# Altium project EMG_Sensor_Board.PrjPcb (part 2 of 2)

## Sheet AFE.SchDoc: Analog Frontend
size A3; ApprovedBy: Robin Geißler; CheckedBy: Robin Geißler; Author: Robin Geißler; CompanyName: Fraunhofer EMFT; DrawnBy: Robin Geißler; Engineer: Robin Geißler; Revision: 1.1.; SheetNumber: 4; SheetTotal: 6
Used 2 times, as channels AFE1, AFE2. Parts and nets are listed once, with the designators drawn on the sheet.
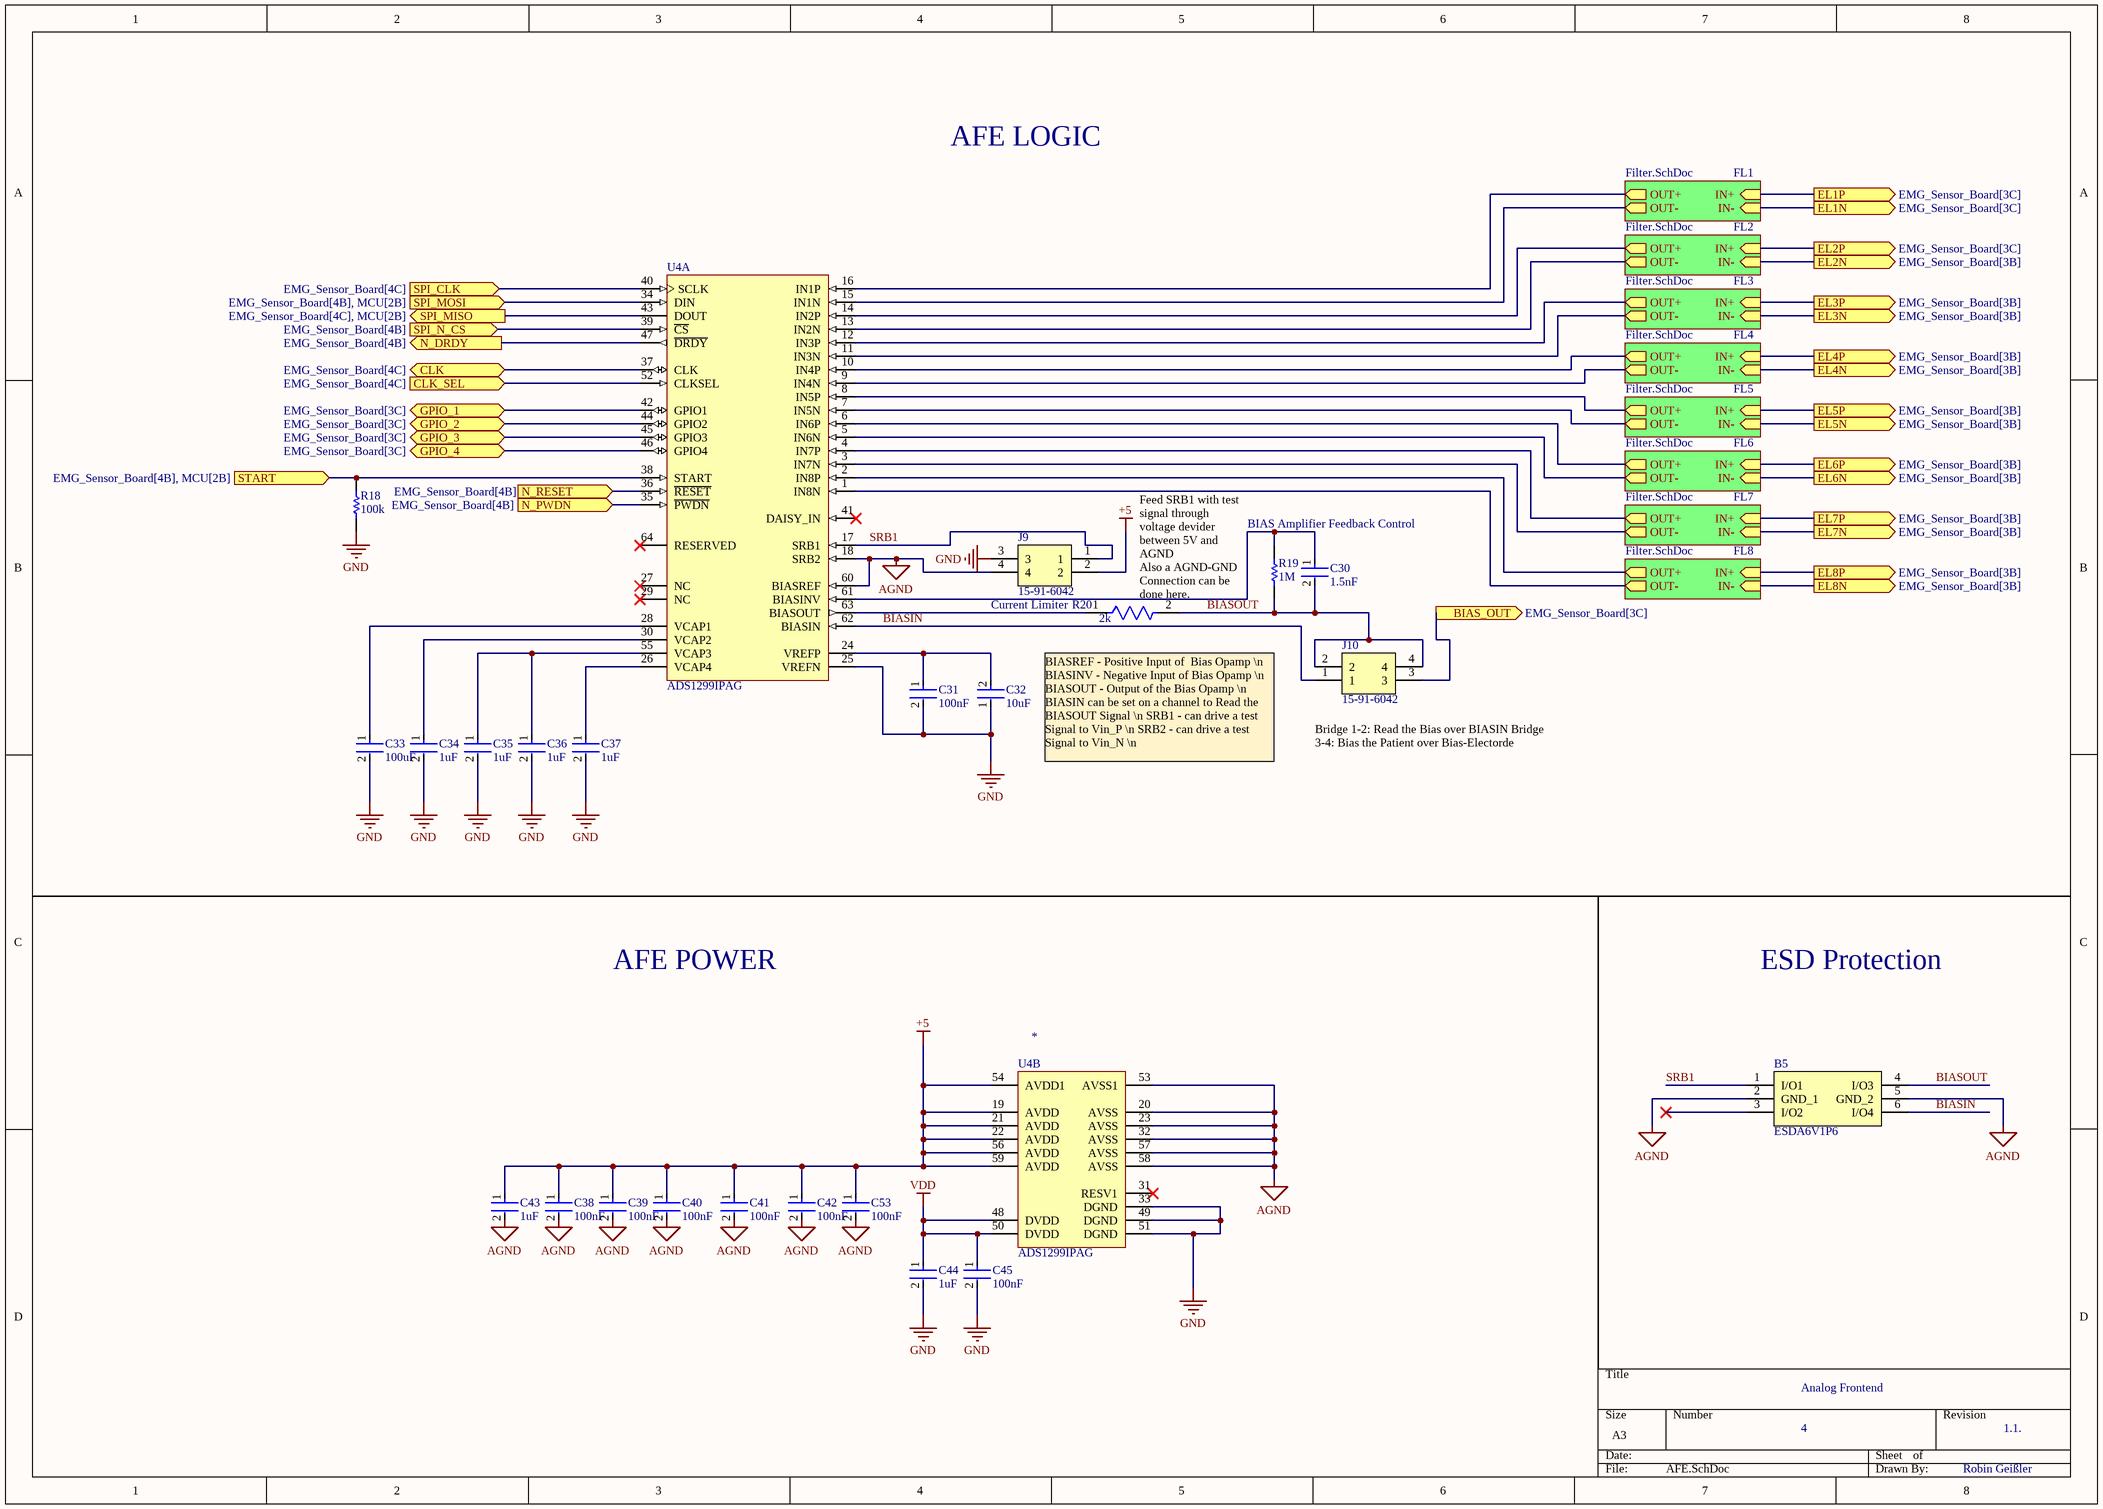
[diagram p3: AFE.SchDoc]

### Parts
B5  ESDA6V1P6  [ESDA6V1P6]
C30  1.5nF  [FP-GRM188-0_1-e0_2_0_5-IPC_B]
C31  100nF  [FP-CGA3E-0_3-0_1-IPC_A]
C32  10uF  [FP-C1608-080-0_1-MFG]
C33  100uF  [FP-C4532-280-0_4-IPC_B]
C34  1uF  [FP-CGA3E-0_3-0_1-IPC_B]
C35  1uF  [FP-CGA3E-0_3-0_1-IPC_B]
C36  1uF  [FP-CGA3E-0_3-0_1-IPC_B]
C37  1uF  [FP-CGA3E-0_3-0_1-IPC_B]
C38  100nF  [FP-CGA3E-0_3-0_1-IPC_A]
C39  100nF  [FP-CGA3E-0_3-0_1-IPC_A]
C40  100nF  [FP-CGA3E-0_3-0_1-IPC_A]
C41  100nF  [FP-CGA3E-0_3-0_1-IPC_A]
C42  100nF  [FP-CGA3E-0_3-0_1-IPC_A]
C43  1uF  [FP-CGA3E-0_3-0_1-IPC_B]
C44  1uF  [FP-CGA3E-0_3-0_1-IPC_B]
C45  100nF  [FP-CGA3E-0_3-0_1-IPC_A]
C53  100nF  [FP-CGA3E-0_3-0_1-IPC_A]
J9  15-91-6042  [15916042]
J10  15-91-6042  [15916042]
R18  100k  [RESC1609X55X30ML10T20]
R19  1M  [RESC1608X55X25LL10T15]
R20  2k  [FP-ERA3A-IPC_C]
U4  ADS1299IPAG  [PAG0064A_N]  (parts A,B of 2)

### Sub-sheets
FL1 = Filter.SchDoc: IN+ (in), IN- (in), OUT+ (out), OUT- (out)
FL2 = Filter.SchDoc: IN+ (in), IN- (in), OUT+ (out), OUT- (out)
FL3 = Filter.SchDoc: IN+ (in), IN- (in), OUT+ (out), OUT- (out)
FL4 = Filter.SchDoc: IN+ (in), IN- (in), OUT+ (out), OUT- (out)
FL5 = Filter.SchDoc: IN+ (in), IN- (in), OUT+ (out), OUT- (out)
FL6 = Filter.SchDoc: IN+ (in), IN- (in), OUT+ (out), OUT- (out)
FL7 = Filter.SchDoc: IN+ (in), IN- (in), OUT+ (out), OUT- (out)
FL8 = Filter.SchDoc: IN+ (in), IN- (in), OUT+ (out), OUT- (out)

### Ports
BIAS_OUT (out, see EMG_Sensor_Board[3C]), CLK (bidir, see EMG_Sensor_Board[4C]), CLK_SEL (in, see EMG_Sensor_Board[4C]), EL1N (out, see EMG_Sensor_Board[3C]), EL1P (out, see EMG_Sensor_Board[3C]), EL2N (out, see EMG_Sensor_Board[3B]), EL2P (out, see EMG_Sensor_Board[3C]), EL3N (out, see EMG_Sensor_Board[3B]), EL3P (out, see EMG_Sensor_Board[3B]), EL4N (out, see EMG_Sensor_Board[3B]), EL4P (out, see EMG_Sensor_Board[3B]), EL5N (out, see EMG_Sensor_Board[3B]), EL5P (out, see EMG_Sensor_Board[3B]), EL6N (out, see EMG_Sensor_Board[3B]), EL6P (out, see EMG_Sensor_Board[3B]), EL7N (out, see EMG_Sensor_Board[3B]), EL7P (out, see EMG_Sensor_Board[3B]), EL8N (out, see EMG_Sensor_Board[3B]), EL8P (out, see EMG_Sensor_Board[3B]), GPIO_1 (bidir, see EMG_Sensor_Board[3C]), GPIO_2 (bidir, see EMG_Sensor_Board[3C]), GPIO_3 (bidir, see EMG_Sensor_Board[3C]), GPIO_4 (bidir, see EMG_Sensor_Board[3C]), N_DRDY (out, see EMG_Sensor_Board[4B]), N_PWDN (in, see EMG_Sensor_Board[4B]), N_RESET (in, see EMG_Sensor_Board[4B]), SPI_CLK (in, see EMG_Sensor_Board[4C]), SPI_MISO (out, see EMG_Sensor_Board[4C], MCU[2B]), SPI_MOSI (in, see EMG_Sensor_Board[4B], MCU[2B]), SPI_N_CS (in, see EMG_Sensor_Board[4B]), START (in, see EMG_Sensor_Board[4B], MCU[2B])

### Nets
+5: C38.1 C39.1 C40.1 C41.1 C42.1 C43.1 C53.1 J9.2 U4.19(AVDD) U4.21(AVDD) U4.22(AVDD) U4.54(AVDD1) U4.56(AVDD) U4.59(AVDD)
AGND: B5.2(GND_1) B5.5(GND_2) C38.2 C39.2 C40.2 C41.2 C42.2 C43.2 C53.2 J9.4 U4.18(SRB2) U4.20(AVSS) U4.23(AVSS) U4.32(AVSS) U4.53(AVSS1) U4.57(AVSS) U4.58(AVSS) U4.60(BIASREF)
GND: C31.2 C32.1 C33.2 C34.2 C35.2 C36.2 C37.2 C44.2 C45.2 J9.3 R18.1 U4.25(VREFN) U4.33(DGND) U4.49(DGND) U4.51(DGND)
VDD: C44.1 C45.1 U4.48(DVDD) U4.50(DVDD)
BIAS_OUT: J10.3 ; port BIAS_OUT
BIASIN: B5.6(I/O4) J10.1 U4.62(BIASIN)
BIASOUT: B5.4(I/O3) C30.2 J10.2 J10.4 R19.1 R20.2
CLK: U4.37(CLK) ; port CLK
CLK_SEL: U4.52(CLKSEL) ; port CLK_SEL
EL1N: port EL1N, sheet FL1/IN-
EL1P: port EL1P, sheet FL1/IN+
EL2N: port EL2N, sheet FL2/IN-
EL2P: port EL2P, sheet FL2/IN+
EL3N: port EL3N, sheet FL3/IN-
EL3P: port EL3P, sheet FL3/IN+
EL4N: port EL4N, sheet FL4/IN-
EL4P: port EL4P, sheet FL4/IN+
EL5N: port EL5N, sheet FL5/IN-
EL5P: port EL5P, sheet FL5/IN+
EL6N: port EL6N, sheet FL6/IN-
EL6P: port EL6P, sheet FL6/IN+
EL7N: port EL7N, sheet FL7/IN-
EL7P: port EL7P, sheet FL7/IN+
EL8N: port EL8N, sheet FL8/IN-
EL8P: port EL8P, sheet FL8/IN+
GPIO_1: U4.42(GPIO1) ; port GPIO_1
GPIO_2: U4.44(GPIO2) ; port GPIO_2
GPIO_3: U4.45(GPIO3) ; port GPIO_3
GPIO_4: U4.46(GPIO4) ; port GPIO_4
N_DRDY: U4.47(~{DRDY}) ; port N_DRDY
N_PWDN: U4.35(~{PWDN}) ; port N_PWDN
N_RESET: U4.36(~{RESET}) ; port N_RESET
SPI_CLK: U4.40(SCLK) ; port SPI_CLK
SPI_MISO: U4.43(DOUT) ; port SPI_MISO
SPI_MOSI: U4.34(DIN) ; port SPI_MOSI
SPI_N_CS: U4.39(~{CS}) ; port SPI_N_CS
SRB1: B5.1(I/O1) J9.1 U4.17(SRB1)
START: R18.2 U4.38(START) ; port START
NetC30_1: C30.1 R19.2 U4.61(BIASINV)
NetC31_1: C31.1 C32.2 U4.24(VREFP)
NetC33_1: C33.1 U4.28(VCAP1)
NetC34_1: C34.1 U4.30(VCAP2)
NetC35_1: C35.1 C36.1 U4.55(VCAP3)
NetC37_1: C37.1 U4.26(VCAP4)
NetR20_1: R20.1 U4.63(BIASOUT)
NetU4_1: U4.1(IN8N) ; sheet FL8/OUT-
NetU4_2: U4.2(IN8P) ; sheet FL8/OUT+
NetU4_3: U4.3(IN7N) ; sheet FL7/OUT-
NetU4_4: U4.4(IN7P) ; sheet FL7/OUT+
NetU4_5: U4.5(IN6N) ; sheet FL6/OUT-
NetU4_6: U4.6(IN6P) ; sheet FL6/OUT+
NetU4_7: U4.7(IN5N) ; sheet FL5/OUT-
NetU4_8: U4.8(IN5P) ; sheet FL5/OUT+
NetU4_9: U4.9(IN4N) ; sheet FL4/OUT-
NetU4_10: U4.10(IN4P) ; sheet FL4/OUT+
NetU4_11: U4.11(IN3N) ; sheet FL3/OUT-
NetU4_12: U4.12(IN3P) ; sheet FL3/OUT+
NetU4_13: U4.13(IN2N) ; sheet FL2/OUT-
NetU4_14: U4.14(IN2P) ; sheet FL2/OUT+
NetU4_15: U4.15(IN1N) ; sheet FL1/OUT-
NetU4_16: U4.16(IN1P) ; sheet FL1/OUT+

Not connected (* = marked no-connect by the designer): B5 3(I/O2)*; U4 27(NC)* 29(NC)* 31(RESV1)* 41(DAISY_IN)* 64(RESERVED)*

### Channels
AFE1: designators B5=B5_AFE1 C30=C30_AFE1 C31=C?#1 C32=C?#2 C33=C?#3 C34=C?#4 C35=C?#5 C36=C?#6 C37=C?#7 C38=C?#9 C39=C?#10 C40=C?#11 C41=C?#12 C42=C?#13 C43=C?#8 C44=C?#14 C45=C?#15 C53=C53_AFE1 J9=J9_AFE1 J10=J10_AFE1 R18=R? R19=R19_AFE1 R20=R20_AFE1 U4=U?#1; ports BIAS_OUT=BIAS_OUT_1 CLK=NetU?#1_37 CLK_SEL=CLK_SEL_1 EL1N=NetC1_15 EL1P=NetC1_16 EL2N=NetC1_13 EL2P=NetC1_14 EL3N=NetC1_11 EL3P=NetC1_12 EL4N=NetC1_9 EL4P=NetC1_10 EL5N=NetC1_7 EL5P=NetC1_8 EL6N=NetC1_5 EL6P=NetC1_6 EL7N=NetC1_3 EL7P=NetC1_4 EL8N=NetC1_1 EL8P=NetC1_2 GPIO_1=NetR24_2 GPIO_2=NetU?#1_44 GPIO_3=NetU?#1_45 GPIO_4=NetU?#1_46 N_DRDY=N_DRDY_1 N_PWDN=N_PWDN_1 N_RESET=N_RESET_1 SPI_CLK=SPI_SCK SPI_MISO=SPI_MISO SPI_MOSI=SPI_MOSI SPI_N_CS=SPI_NCS_1 START=START
AFE2: designators B5=B5_AFE2 C30=C30_AFE2 C31=C31_AFE2 C32=C32_AFE2 C33=C33_AFE2 C34=C34_AFE2 C35=C35_AFE2 C36=C36_AFE2 C37=C37_AFE2 C38=C38_AFE2 C39=C39_AFE2 C40=C40_AFE2 C41=C41_AFE2 C42=C42_AFE2 C43=C43_AFE2 C44=C44_AFE2 C45=C45_AFE2 C53=C53_AFE2 J9=J9_AFE2 J10=J10_AFE2 R18=R18_AFE2 R19=R19_AFE2 R20=R20_AFE2 U4=U?#2; ports BIAS_OUT=BIAS_OUT_2 CLK=NetU?#1_37 CLK_SEL=CLK_SEL_2 EL1N=NetC1_31 EL1P=NetC1_32 EL2N=NetC1_29 EL2P=NetC1_30 EL3N=NetC1_27 EL3P=NetC1_28 EL4N=NetC1_25 EL4P=NetC1_26 EL5N=NetC1_23 EL5P=NetC1_24 EL6N=NetC1_21 EL6P=NetC1_22 EL7N=NetC1_19 EL7P=NetC1_20 EL8N=NetC1_17 EL8P=NetC1_18 GPIO_1=NetR25_1 GPIO_2=NetU?#2_44 GPIO_3=NetU?#2_45 GPIO_4=NetU?#2_46 N_DRDY=N_DRDY_2 N_PWDN=N_PWDN_2 N_RESET=N_RESET_2 SPI_CLK=SPI_SCK SPI_MISO=SPI_MISO SPI_MOSI=SPI_MOSI SPI_N_CS=SPI_NCS_2 START=START

### Notes on the sheet
- AFE LOGIC
- BIAS Amplifier Feedback Control
- Current Limiter
- (near R20) Feed SRB1 with test signal through voltage devider between 5V and AGND
  Also a AGND-GND Connection can be done here.
- BIASREF - Positive Input of  Bias Opamp \n BIASINV - Negative Input of Bias Opamp \n BIASOUT - Output of the Bias Opamp \n BIASIN can be set on a channel to Read the BIASOUT Signal \n SRB1 - can drive a test Signal to Vin_P \n SRB2 - can drive a test Signal to Vin_N \n
- (near J10) Bridge 1-2: Read the Bias over BIASIN Bridge 3-4: Bias the Patient over Bias-Electorde
- AFE POWER
- ESD Protection

### Library data of the parts
B5 = ESDA6V1P6: 4 line ESD protection, 6.1 V VBR, in SOT666; Manufacturer_Name: STMicroelectronics; Geometry.Height: 0.62mm; Manufacturer_Part_Number: ESDA6V1P6; Mouser Part Number: 511-ESDA6V1P6; Mouser Price/Stock: https://www.mouser.co.uk/ProductDetail/STMicroelectronics/ESDA6V1P6?qs=ewe0KQ%2FSs5H0%252BSAub%2FR2ag%3D%3D; Arrow Part Number: ESDA6V1P6; Arrow Price/Stock: https://www.arrow.com/en/products/esda6v1p6/stmicroelectronics?region=nac; Datasheet Link: https://www.st.com/resource/en/datasheet/esda14v2bp6.pdf; Supplier 1: Mouser; Supplier Part Number 1: 511-ESDA6V1P6
C30 = CMP-06035-043535-1: Chip Multilayer Ceramic Capacitors for General Purpose, 0603, 1500pF, C0G, 30ppm/°C, 5%, 50V; Insulation Resistance: 10GR; Lead Free: Lead Free; REACH SVHC: No SVHC; Dielectric: C0G; Package Quantity: 1; Case/Package: 0603; Material: Ceramic; Height: 0.8mm; Length: 1.6mm; Max Operating Temperature: 125°C; Thickness: 0.035inch; Mount: Surface Mount; Depth: 0.8mm; Case Code (Metric): 1608; Dielectric Material: Ceramic; Radiation Hardening: No; Capacitance: 1.5nF; Termination: SMD/SMT; Tolerance: 5%; Number of Pins: 2; Temperature Coefficient: 30ppm/°C; Packaging: Tape and Reel; Width: 0.8mm; Voltage: 50V; Case Code (Imperial): 0603; Voltage Rating: 50V; Voltage Rating (DC): 50V; Min Operating Temperature: -55°C
C31 C38-C42 C45 C53 = CMP-2000-07546-2: Cap Ceramic 100nF 50V X7R 10% Pad SMD 0603 +125°C Automotive T/R; Weight: 7.1E-05oz; Composition: Ceramic; Max Operating Temperature: 125°C; Termination: SMD/SMT; Dielectric: X7R; Length: 1.6mm; Package Quantity: 1; REACH SVHC: No SVHC; Lead Free: Lead Free; Case Code (Metric): 1608; Min Operating Temperature: -55°C; Packaging: Tape and Reel; Tolerance: 10%; Voltage Rating: 50V; Case Code (Imperial): 0603; Capacitance: 100nF; Case/Package: 0603; Voltage Rating (DC): 50V; Depth: 0.8mm; Radiation Hardening: No; Ratings: AEC-Q200; Mount: Surface Mount; Voltage: 50V; Thickness: 0.035inch; Width: 0.8mm; Height: 0.8mm
C32 = CMP-2000-04979-3: Multilayer Ceramic Capacitors 10μF ±10% 10V X5R SMD 0603; Dielectric Material: Ceramic; Construction: Flat; Height: 0.8mm; Thickness: 0.035inch; Case Code (Metric): 1608; Radiation Hardening: No; Number of Pins: 2; Voltage Rating (DC): 10V; Depth: 0.8mm; Voltage: 10V; RoHS Compliant: Yes; Voltage Rating: 10V; Package Quantity: 1; Resistor Type: Ceramic; Termination: SMD/SMT; Lead Free: Lead Free; REACH SVHC: No SVHC; Tolerance: 10%; Mount: Surface Mount; Series: C; Packaging: Tape and Reel; Width: 0.8mm; Dielectric: X5R; Weight: 7.1E-05oz; Length: 1.6mm; Max Operating Temperature: 85°C; Case Code (Imperial): 0603; Case/Package: 0603; Min Operating Temperature: -55°C; Capacitance: 10uF
C33 = CMP-08246-002633-1: CAP CER 100UF 6.3V X6S 1812; Tolerance: 20%; Dielectric Material: Ceramic; Min Operating Temperature: -55°C; Package Quantity: 500; Voltage Rating (DC): 6.3V; Width: 0.126inch; Packaging: Tape and Reel; Series: C; Case Code (Metric): 4532; Lead Free: Lead Free; Mount: Surface Mount; Case Code (Imperial): 1812; Max Operating Temperature: 105°C; Capacitance: 100uF; Length: 0.177inch; Case/Package: 1812; Voltage Rating: 6.3V; Thickness: 0.122inch; RoHS Compliant: Yes
C34-C37 C43 C44 = CMP-08246-002551-1: Cap Ceramic 1uF 35V X7R 10% Pad SMD 0603 +125°C Automotive T/R; Termination: SMD/SMT; Packaging: Tape and Reel; Capacitance: 1uF; Tolerance: 10%; Mount: Surface Mount; Thickness: 0.035inch; Case Code (Imperial): 0603; Voltage Rating: 35V; Case/Package: 0603; Case Code (Metric): 1608; Dielectric: X7R; Width: 0.031inch; Length: 0.063inch; Min Operating Temperature: -55°C; Weight: 7.1E-05oz; Max Operating Temperature: 125°C; Voltage Rating (DC): 35V; Height: 0.8mm; Ratings: AEC-Q200; Package Quantity: 4000
J9 J10 = 15-91-6042: 2.54mm Pitch SL Wire-to-Board Header, Low Profile, Surface Mount, Single Row, Right-Angle, 3.05mm Pocket, Shrouded, with Press-fit Plastic Peg,  Circuits, Tin (Sn) Plating, Embossed Tape Packaging; Manufacturer_Name: Molex; Geometry.Height: 11.69mm; Manufacturer_Part_Number: 15-91-6042; Mouser Part Number: 538-15-91-6042; Mouser Price/Stock: https://www.mouser.co.uk/ProductDetail/Molex/15-91-6042?qs=3DzawVMofg8HeBuyct9LCA%3D%3D; Arrow Part Number: *; Arrow Price/Stock: *; Datasheet Link: https://componentsearchengine.com/Datasheets/1/15-91-6042.pdf
R18 = CMP-2000-03685-1: TNPW0603100KBEEA; Manufacturer: Vishay Dale; Part Number: TNPW0603100KBEEA
R19 = CMP-1659-00056-1: Chip Resistor, 1 MOhm, +/- 1%, 100 mW, -55 to 155 degC, 0603 (1608 Metric), RoHS, Tape and Reel; Voltage Rating (DC): 25 V; Tolerance: 20%; Case\Package: Radial; Capacitance: 1 mF; Min Operating Temperature: -40 degC; PackageDescription: 2-Pin Surface Mount Device, Body 1.6 x 0.8 mm; ComponentLink1Description: Manufacturer URL; Radiation Hardening: No; DatasheetVersion: Rev. 4, 02/2016; REACH SVHC: No SVHC; Length: 20 mm; Max Operating Temperature: 85 degC; Diameter: 10 mm; Packaging: Bulk; Package Quantity: 200; PackageReference: 0603; Mount: Through Hole; ComponentLink1URL: http://www.yageo.com/; ComponentLink2URL: http://www.yageo.com/documents/recent/PYu-RC_Group_51_RoHS_L_04.pdf; ComponentLink2Description: Datasheet; Width: 0 inch; Lead Pitch: 5 mm; RoHSCompliant: true; Voltage Rating: 25 V; Height: 20 mm
R20 = CMP-2000-00945-2: RES SMD 2K OHM 0.1% 1/10W 0603; Resistance: 2kR; Max Power Dissipation: 100mW; Voltage Rating (DC): 75V; Temperature Coefficient: 25ppm/°C; REACH SVHC: No SVHC; Number of Terminations: 2; RoHS Compliant: Yes; Case Code (Metric): 1608; Package Quantity: 5000; Width: 0.8mm; Mount: Surface Mount; Series: ERA-3A; Number of Pins: 2; Height: 0.45mm; Military Standard: Not; Packaging: Tape and Reel; Resistor Type: Thin Film; Lead Free: Lead Free; Construction: Rectangular; Max Operating Temperature: 155°C; Contact Plating: Tin; Termination: SMD/SMT; Technology: THIN FILM; Length: 1.6mm; Power Rating: 100mW; Resistance Tolerance: 0.1%; Working Voltage: 75V; Voltage Rating: 75V; Depth: 0.8mm; Case Code (Imperial): 0603; Radiation Hardening: No; Case/Package: 0603; Tolerance: 0.1%; Min Operating Temperature: -55°C
U4 = CMP-0841-00002-2: Low-Noise, 8-Channel, 24-Bit Analog Front-End for Biopotential Measurement, 16 KSPS, -40 to 85 degC, 64-Pin PQFP (PAG-64), RoHS, Tube; Manufacturer: Texas Instruments; Architecture: Delta-Sigma; Reference Mode: Int, Ext; # Input Channels: 8; Resolution (Bits): 24; Sample Rate (max) (KSPS): 16; Interface: Serial SPI; Packing: PAG0064A; PackageVersion: 4040282/C; PackageReference: PAG-64; ComponentLink3Description: Package Specification; DatasheetVersion: SBAS499A; ComponentLink1Description: Manufacturer URL; ComponentLink2Description: Datasheet; PackageDescription: 64-Pin Plastic Quad Flatpack, Body 10 x 10 mm, Pitch 0.5 mm; RoHS: TRUE; Operating Temperature Range (C): -40 to 85; ComponentLink3URL: http://www.ti.com/lit/ml/mtqf006a/mtqf006a.pdf; ComponentLink1URL: http://www.ti.com/; ComponentLink2URL: http://www.ti.com/lit/ds/symlink/ads1299.pdf; PartNumber: ADS1299IPAG; Mounting Technology: Surface Mount

## Sheet Filter.SchDoc: Filter
size A4; Author: Robin Geißler; CompanyName: Fraunhofer EMFT; DrawnBy: Robin Geißler; Revision: 1.1.; SheetNumber: 5; SheetTotal: 6
Used 16 times, as channels AFE1/FL7, AFE1/FL6, AFE1/FL8, AFE1/FL5, AFE1/FL4, AFE1/FL3, AFE1/FL2, AFE1/FL1, AFE2/FL7, AFE2/FL6, AFE2/FL8, AFE2/FL5, AFE2/FL4, AFE2/FL3, AFE2/FL2, AFE2/FL1. Parts and nets are listed once, with the designators drawn on the sheet.
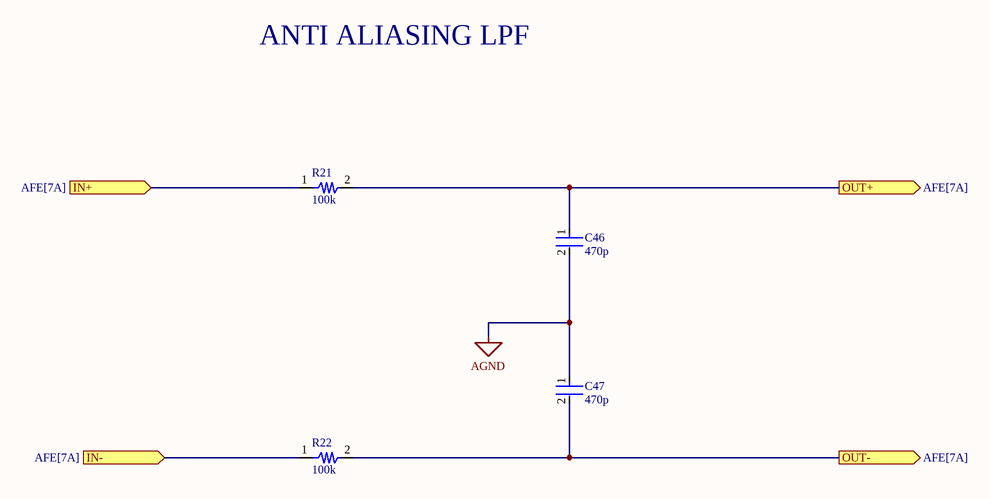
[diagram p4: Filter.SchDoc]

### Parts
C46  470p  [FP-C0603C-CF-MFG]
C47  470p  [FP-C0603C-CF-MFG]
R21  100k  [R-1608 [0603]-M]
R22  100k  [R-1608 [0603]-M]

### Ports
IN+ (in, see AFE[7A]), IN- (in, see AFE[7A]), OUT+ (out, see AFE[7A]), OUT- (out, see AFE[7A])

### Nets
AGND: C46.2 C47.1
IN+: R21.1 ; port IN+
IN-: R22.1 ; port IN-
OUT+: C46.1 R21.2 ; port OUT+
OUT-: C47.2 R22.2 ; port OUT-

### Channels
AFE1/FL7: designators end in _AFE1_FL7; ports IN+=NetC1_4 IN-=NetC1_3 OUT+=NetC46_AFE1_FL7_1 OUT-=NetC47_AFE1_FL7_2
AFE1/FL6: designators end in _AFE1_FL6; ports IN+=NetC1_6 IN-=NetC1_5 OUT+=NetC46_AFE1_FL6_1 OUT-=NetC47_AFE1_FL6_2
AFE1/FL8: designators end in _AFE1_FL8; ports IN+=NetC1_2 IN-=NetC1_1 OUT+=NetC46_AFE1_FL8_1 OUT-=NetC47_AFE1_FL8_2
AFE1/FL5: designators end in _AFE1_FL5; ports IN+=NetC1_8 IN-=NetC1_7 OUT+=NetC46_AFE1_FL5_1 OUT-=NetC47_AFE1_FL5_2
AFE1/FL4: designators end in _AFE1_FL4; ports IN+=NetC1_10 IN-=NetC1_9 OUT+=NetC46_AFE1_FL4_1 OUT-=NetC47_AFE1_FL4_2
AFE1/FL3: designators end in _AFE1_FL3; ports IN+=NetC1_12 IN-=NetC1_11 OUT+=NetC46_AFE1_FL3_1 OUT-=NetC47_AFE1_FL3_2
AFE1/FL2: designators end in _AFE1_FL2; ports IN+=NetC1_14 IN-=NetC1_13 OUT+=NetC46_AFE1_FL2_1 OUT-=NetC47_AFE1_FL2_2
AFE1/FL1: designators end in _AFE1_FL1; ports IN+=NetC1_16 IN-=NetC1_15 OUT+=NetC46_AFE1_FL1_1 OUT-=NetC47_AFE1_FL1_2
AFE2/FL7: designators end in _AFE2_FL7; ports IN+=NetC1_20 IN-=NetC1_19 OUT+=NetC46_AFE2_FL7_1 OUT-=NetC47_AFE2_FL7_2
AFE2/FL6: designators end in _AFE2_FL6; ports IN+=NetC1_22 IN-=NetC1_21 OUT+=NetC46_AFE2_FL6_1 OUT-=NetC47_AFE2_FL6_2
AFE2/FL8: designators end in _AFE2_FL8; ports IN+=NetC1_18 IN-=NetC1_17 OUT+=NetC46_AFE2_FL8_1 OUT-=NetC47_AFE2_FL8_2
AFE2/FL5: designators end in _AFE2_FL5; ports IN+=NetC1_24 IN-=NetC1_23 OUT+=NetC46_AFE2_FL5_1 OUT-=NetC47_AFE2_FL5_2
AFE2/FL4: designators end in _AFE2_FL4; ports IN+=NetC1_26 IN-=NetC1_25 OUT+=NetC46_AFE2_FL4_1 OUT-=NetC47_AFE2_FL4_2
AFE2/FL3: designators end in _AFE2_FL3; ports IN+=NetC1_28 IN-=NetC1_27 OUT+=NetC46_AFE2_FL3_1 OUT-=NetC47_AFE2_FL3_2
AFE2/FL2: designators end in _AFE2_FL2; ports IN+=NetC1_30 IN-=NetC1_29 OUT+=NetC46_AFE2_FL2_1 OUT-=NetC47_AFE2_FL2_2
AFE2/FL1: designators end in _AFE2_FL1; ports IN+=NetC1_32 IN-=NetC1_31 OUT+=NetC46_AFE2_FL1_1 OUT-=NetC47_AFE2_FL1_2

### Notes on the sheet
- ANTI ALIASING LPF

### Library data of the parts
C46 C47 = CMP-1035-01678-2: C0603 470 pF C0G 30ppm/°C 1.00% 100 V; Manufacturer: KEMET; Manufacturer Part Number: C0603C471F1GACTU; Material: Ceramic; Automotive Grade: Grade 1; Voltage Rating: 100 V; Capacitance: 470 pF; Value: 470 pF; Tolerance: 0.01; RoHS: TRUE; Lead Free: Yes; Category: Cap; ComponentLink2Description: Datasheet; Temperature Range Low: -55°C; Temperature: -55°C to +125°C; Mouser Description: Multilayer Ceramic Capacitors MLCC - SMD/SMT 100volts 470pF 1% C0G; Device Class L2: Capacitors; Octopart: https://octopart.com/c0603c471f1gactu-kemet-26647159; Device Class L3: Ceramic Capacitors; Temperature Characteristic: C0G; Device Class L1: Passive Components; Temperature Coefficient: 30ppm/°C; Temperature Range High: +125°C; ComponentLink2URL: https://api.kemet.com/component-edge/download/datasheet/C0603C100J5GACAUTO.pdf; Automotive: Yes; Package: C0603C-CF; Height: 0.87mm
R21 R22 = Precision_Resistor: Expensive: P2TC0603D1003LNTA - 0.01% Cheap: TNPU0603100KAYEN00 - 0.05%; Supplier 1: Rs; Supplier Part Number 1: 2182743P; Supplier 2: Arrow Electronics; Supplier Part Number 2: TNPU0603100KAYEN00

## Sheet RF.SchDoc: Radio Frequency
size A4; Author: Robin Geißler; CompanyName: Fraunhofer EMFT; DrawnBy: Robin Geißler; Revision: 1.1.; SheetNumber: 6; SheetTotal: 6
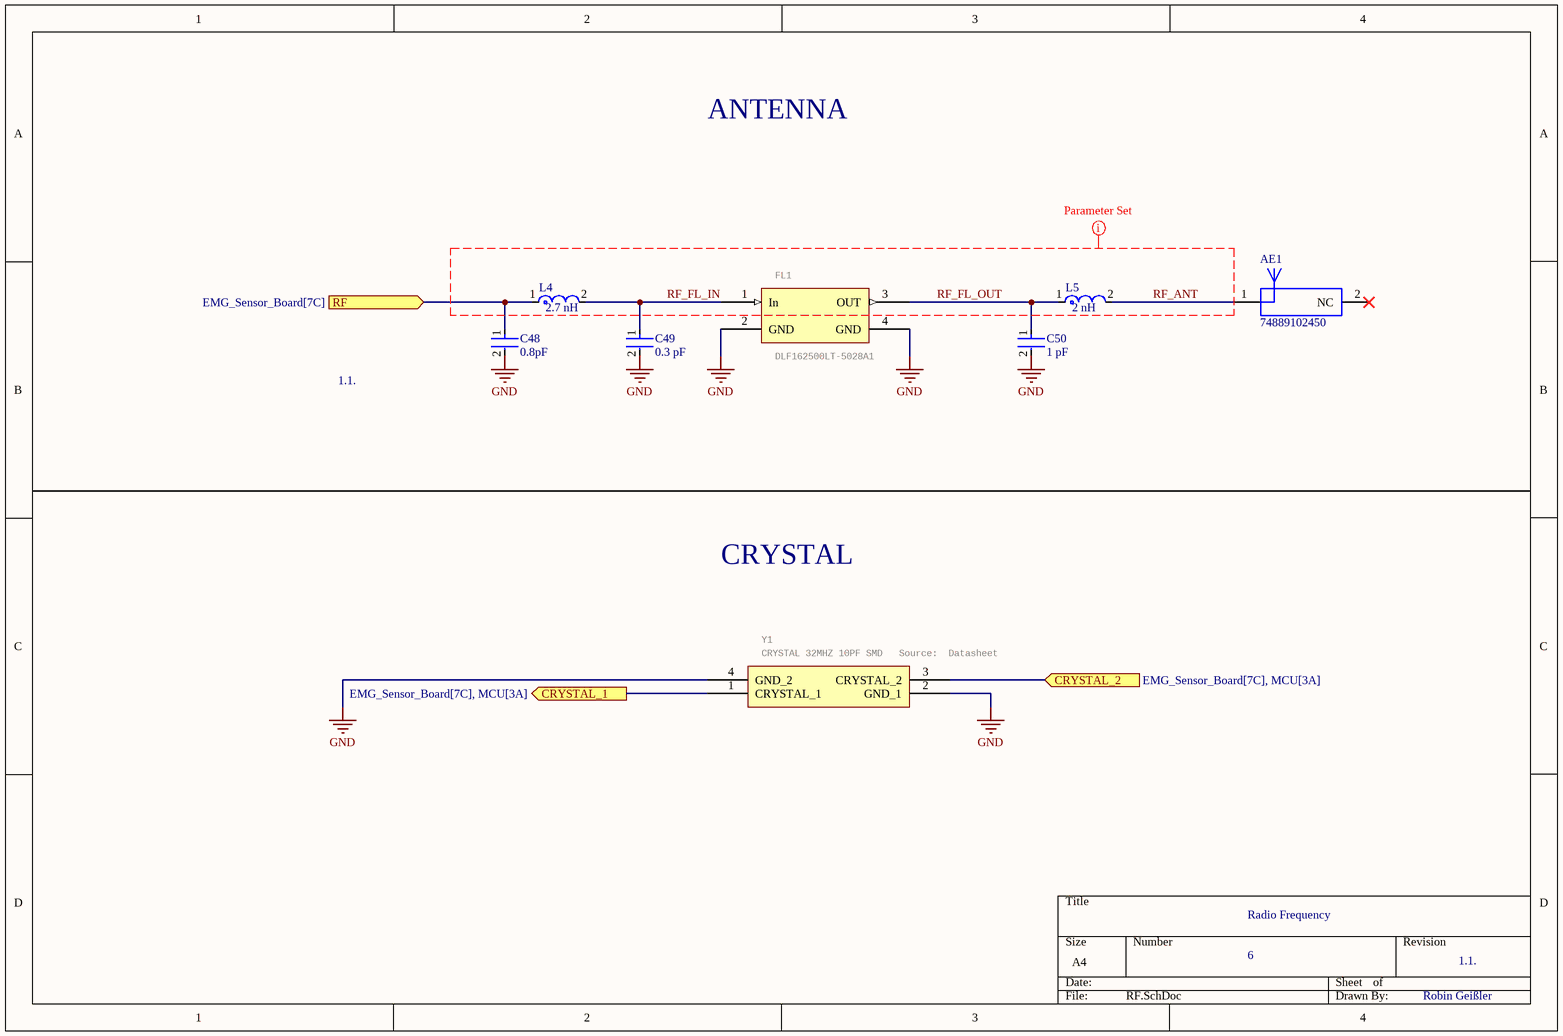
[diagram p5: RF.SchDoc]

### Parts
AE1  74889102450  [74889102450]
C48  0.8pF  [FP-GCM188-0_1-IPC_C]
C49  0.3 pF  [FP-GQM187-0_15-IPC_A]
C50  1 pF  [FP-C0603C-CF-MFG]
FL1  DLF162500LT-5028A1  [DLF162500LT5028A1]
L4  2.7 nH  [FP-LQG15HH_02-IPC_C]
L5  2 nH  [FP-LQP03TG_02-IPC_A]
Y1  CRYSTAL 32MHZ 10PF SMD   Source:  Datasheet  [NX2016SA32MEXS00ACS06465]

### Ports
CRYSTAL_1 (out, see EMG_Sensor_Board[7C], MCU[3A]), CRYSTAL_2 (in, see EMG_Sensor_Board[7C], MCU[3A]), RF (in, see EMG_Sensor_Board[7C])

### Nets
GND: C48.2 C49.2 C50.2 FL1.2(GND) FL1.4(GND) Y1.2(GND_1) Y1.4(GND_2)
CRYSTAL_1: Y1.1(CRYSTAL_1) ; port CRYSTAL_1
CRYSTAL_2: Y1.3(CRYSTAL_2) ; port CRYSTAL_2
RF1: C48.1 L4.1 ; port RF
RF_ANT: AE1.1(Feed) L5.2
RF_FL_IN: C49.1 FL1.1(In) L4.2
RF_FL_OUT: C50.1 FL1.3(OUT) L5.1

Not connected (* = marked no-connect by the designer): AE1 2(NC)*

### Layout directives
net class RF: RF_ANT, RF_FL_IN, RF_FL_OUT

### Notes on the sheet
- ANTENNA
- CRYSTAL

### Library data of the parts
AE1 = CMP-03913-126098686-1: 74889102450 Chip Antenna, 2.45Ghz, 9Mm X 2Mm X 1Mm Rohs Compliant: Yes; Current Rating: 2A; Impedance: 50Ω; Height: 1.01mm; RoHS: Compliant; Max Operating Temperature: 85°C; NexarPartId: 126098686; Min Operating Temperature: -40°C; Width: 2mm; Length: 9mm
C48 = CMP-06035-009191-1: Ceramic Capacitor for Automotive 0.8pF  ±0.1pF 100VDC C0G 0603 Paper T/R
C49 = CMP-06035-023113-1: Ceramic Capacitor 0.3pF ±0.05pF 250VDC C0G 0603 Paper T/R
C50 = CMP-2006-03328-2: CAP CER 1PF 50V C0G/NP0 0603; Manufacturer: KEMET; Manufacturer Part Number: C0603C109C5GACTU; Value: 1.0 pF; Temperature Characteristic: C0G; Tolerance: 0.25 pF; Temperature Coefficient: 30ppm/°C; Automotive Grade: Grade 1; Material: Ceramic; Device Class L1: Passive Components; Temperature Range High: +125°C; Temperature: -55°C to +125°C; Height: 0.87mm; Digikey Description: CAP CER 1PF 50V C0G/NP0 0603; Voltage Rating: 50 V; ComponentLink2Description: Datasheet; Capacitance: 1.0 pF; Lead Free: Yes; ComponentLink2URL: https://api.kemet.com/component-edge/download/datasheet/C0603C100J5GACAUTO.pdf; Mouser Description: Multilayer Ceramic Capacitors MLCC - SMD/SMT 50volts 1.0pF C0G 0.25%; Temperature Range Low: -55°C; Device Class L3: Ceramic Capacitors; Device Class L2: Capacitors; Automotive: Yes; RoHS: TRUE; Package: C0603C-CF; Category: Cap; Octopart: https://octopart.com/c0603c109c5gactu-kemet-107248
FL1 = DLF162500LT-5028A1: Signal Conditioning LTCC LOW PASS FLTR 2400-2500MHz   Source:  Datasheet; Manufacturer_Name: TDK; Manufacturer_Part_Number: DLF162500LT-5028A1; Mouser_Part_Number: 810-DLF16250LT5028A1; Mouser_Price-Stock: https://www.mouser.co.uk/ProductDetail/TDK/DLF162500LT-5028A1?qs=U%2FZX79kHR%2FlwIbAISCs3qA%3D%3D; Arrow_Part_Number: DLF162500LT-5028A1; Arrow_Price-Stock: https://www.arrow.com/en/products/dlf162500lt-5028a1/tdk?region=nac; Height: 0.4mm
L4 = CMP-2000-06580-2: Multilayer type RF Inductor 2.7nH ±0.3nH 0.12Ω 800mA 0402; Max DC Current: 300mA; Q Factor: 8; Core Material: Air; Test Frequency: 100MHz; Shielding: Unshielded; Self Resonant Frequency: 6GHz; DC Resistance (DCR): 150mR; Packaging: Tape and Reel; Depth: 0.55mm; DC Current: 300mA; Length: 1mm; Current Rating: 300mA; Lead Free: Lead Free; Max Operating Temperature: 125°C; Mount: Surface Mount; Height - Seated (Max): 0.022inch; Case Code (Imperial): 0402; Height: 0.5mm; Termination: SMD/SMT; Package Quantity: 10000; Radiation Hardening: No; Width: 0.5mm; Case Code (Metric): 1005; Min Operating Temperature: -55°C; Military Standard: Not; Case/Package: 0402; Inductance: 2.7nH
L5 = CMP-06042-013297-1: Film type RF Inductor 2nH ±0.1nH 600mA 0.15Ω 0201 (0603); Current: 400mA; DC Resistance (DCR): 150mR; Core Material: Non-Magnetic; Q Factor: 14; Shielding: Unshielded; Self Resonant Frequency: 12.5GHz; Test Frequency: 500MHz; Height - Seated (Max): 0.013inch; Case/Package: 0201; Depth: 0.33mm; Width: 0.012inch; Mount: Surface Mount; Case Code (Imperial): 0201; Packaging: Tape and Reel; Max DC Current: 600mA; Resistor Type: Thin Film; Case Code (Metric): 0603; Length: 0.6mm; Termination: SMD/SMT; Max Operating Temperature: 125°C; Inductance: 2nH; REACH SVHC: No SVHC; DC Current: 600mA; Package Quantity: 15000; Height: 0.3mm; Military Standard: Not; Min Operating Temperature: -55°C; Current Rating: 600mA
Y1 = NX2016SA-32M-EXS00A-CS06465: Manufacturer_Name: NDK; GateName_1: G$1; SymbolName_1: NX2016SA-32M-EXS00A-CS06465; LibraryName: NX2016SA-32M-EXS00A-CS06465; DeviceSetName: NX2016SA-32M-EXS00A-CS06465; Package: NX2016SA32MEXS00ACS06465; Manufacturer_Part_Number: NX2016SA-32M-EXS00A-CS06465; Mouser_Part_Number: 344-NX2016SA32S06465; Mouser_Price-Stock: https://www.mouser.co.uk/ProductDetail/NDK/NX2016SA-32M-EXS00A-CS06465?qs=w%2Fv1CP2dgqr82b0JjRnv4A%3D%3D; Height: 0.5mm

## Nets that join several sheets
3V3: EMG_Sensor_Board (J1.1 J3.4), MCU (28 pins), Power_Supply (C5.1 J8.2 R2.2), AFE1 (C?#14.1 C?#15.1 U?#1.48 U?#1.50), AFE2 (C44_AFE2.1 C45_AFE2.1 U?#2.48 U?#2.50)
5V: Power_Supply (J8.3 R5.2), AFE1 (14 pins), AFE2 (14 pins)
AGND: EMG_Sensor_Board (D2.2 P1.1), Power_Supply (10 pins), AFE1 (18 pins), AFE1/FL7 (C46_AFE1_FL7.2 C47_AFE1_FL7.1), AFE1/FL6 (C46_AFE1_FL6.2 C47_AFE1_FL6.1), AFE1/FL8 (C46_AFE1_FL8.2 C47_AFE1_FL8.1), AFE1/FL5 (C46_AFE1_FL5.2 C47_AFE1_FL5.1), AFE1/FL4 (C46_AFE1_FL4.2 C47_AFE1_FL4.1), AFE1/FL3 (C46_AFE1_FL3.2 C47_AFE1_FL3.1), AFE1/FL2 (C46_AFE1_FL2.2 C47_AFE1_FL2.1), AFE1/FL1 (C46_AFE1_FL1.2 C47_AFE1_FL1.1), AFE2 (18 pins), AFE2/FL7 (C46_AFE2_FL7.2 C47_AFE2_FL7.1), AFE2/FL6 (C46_AFE2_FL6.2 C47_AFE2_FL6.1), AFE2/FL8 (C46_AFE2_FL8.2 C47_AFE2_FL8.1), AFE2/FL5 (C46_AFE2_FL5.2 C47_AFE2_FL5.1), AFE2/FL4 (C46_AFE2_FL4.2 C47_AFE2_FL4.1), AFE2/FL3 (C46_AFE2_FL3.2 C47_AFE2_FL3.1), AFE2/FL2 (C46_AFE2_FL2.2 C47_AFE2_FL2.1), AFE2/FL1 (C46_AFE2_FL1.2 C47_AFE2_FL1.1)
GND: EMG_Sensor_Board (19 pins), MCU (29 pins), Power_Supply (22 pins), AFE1 (15 pins), RF (7 pins), AFE2 (15 pins)
BAT_STAT: MCU (U3.46), Power_Supply (U2.1)
BIAS_OUT_1: EMG_Sensor_Board (J11.4), AFE1 (J10_AFE1.3)
BIAS_OUT_2: EMG_Sensor_Board (J11.3), AFE2 (J10_AFE2.3)
CLK_SEL_1: MCU (U3.58), AFE1 (U?#1.52)
CLK_SEL_2: EMG_Sensor_Board (B4.3 J6.1), MCU (U3.2), AFE2 (U?#2.52)
CRYSTAL_1: MCU (U3.35), RF (Y1.1)
CRYSTAL_2: MCU (U3.34), RF (Y1.3)
N_DRDY_1: EMG_Sensor_Board (B3.4 J4.3), MCU (U3.59), AFE1 (U?#1.47)
N_DRDY_2: EMG_Sensor_Board (B4.4 J6.2), MCU (U3.17), AFE2 (U?#2.47)
N_PWDN_1: EMG_Sensor_Board (B3.3 J4.2), MCU (U3.61), AFE1 (U?#1.35)
N_PWDN_2: EMG_Sensor_Board (B4.1 J6.3), MCU (U3.6), AFE2 (U?#2.35)
N_RESET_1: EMG_Sensor_Board (B3.1 J4.4), MCU (U3.60), AFE1 (U?#1.36)
N_RESET_2: EMG_Sensor_Board (B4.6 J6.4), MCU (U3.16), AFE2 (U?#2.36)
NetC1_1: EMG_Sensor_Board (C1.1), AFE1/FL8 (R22_AFE1_FL8.1)
NetC1_2: EMG_Sensor_Board (C1.2), AFE1/FL8 (R21_AFE1_FL8.1)
NetC1_3: EMG_Sensor_Board (C1.3), AFE1/FL7 (R22_AFE1_FL7.1)
NetC1_4: EMG_Sensor_Board (C1.4), AFE1/FL7 (R21_AFE1_FL7.1)
NetC1_5: EMG_Sensor_Board (C1.5), AFE1/FL6 (R22_AFE1_FL6.1)
NetC1_6: EMG_Sensor_Board (C1.6), AFE1/FL6 (R21_AFE1_FL6.1)
NetC1_7: EMG_Sensor_Board (C1.7), AFE1/FL5 (R22_AFE1_FL5.1)
NetC1_8: EMG_Sensor_Board (C1.8), AFE1/FL5 (R21_AFE1_FL5.1)
NetC1_9: EMG_Sensor_Board (C1.9), AFE1/FL4 (R22_AFE1_FL4.1)
NetC1_10: EMG_Sensor_Board (C1.10), AFE1/FL4 (R21_AFE1_FL4.1)
NetC1_11: EMG_Sensor_Board (C1.11), AFE1/FL3 (R22_AFE1_FL3.1)
NetC1_12: EMG_Sensor_Board (C1.12), AFE1/FL3 (R21_AFE1_FL3.1)
NetC1_13: EMG_Sensor_Board (C1.13), AFE1/FL2 (R22_AFE1_FL2.1)
NetC1_14: EMG_Sensor_Board (C1.14), AFE1/FL2 (R21_AFE1_FL2.1)
NetC1_15: EMG_Sensor_Board (C1.15), AFE1/FL1 (R22_AFE1_FL1.1)
NetC1_16: EMG_Sensor_Board (C1.16), AFE1/FL1 (R21_AFE1_FL1.1)
NetC1_17: EMG_Sensor_Board (C1.17), AFE2/FL8 (R22_AFE2_FL8.1)
NetC1_18: EMG_Sensor_Board (C1.18), AFE2/FL8 (R21_AFE2_FL8.1)
NetC1_19: EMG_Sensor_Board (C1.19), AFE2/FL7 (R22_AFE2_FL7.1)
NetC1_20: EMG_Sensor_Board (C1.20), AFE2/FL7 (R21_AFE2_FL7.1)
NetC1_21: EMG_Sensor_Board (C1.21), AFE2/FL6 (R22_AFE2_FL6.1)
NetC1_22: EMG_Sensor_Board (C1.22), AFE2/FL6 (R21_AFE2_FL6.1)
NetC1_23: EMG_Sensor_Board (C1.23), AFE2/FL5 (R22_AFE2_FL5.1)
NetC1_24: EMG_Sensor_Board (C1.24), AFE2/FL5 (R21_AFE2_FL5.1)
NetC1_25: EMG_Sensor_Board (C1.25), AFE2/FL4 (R22_AFE2_FL4.1)
NetC1_26: EMG_Sensor_Board (C1.26), AFE2/FL4 (R21_AFE2_FL4.1)
NetC1_27: EMG_Sensor_Board (C1.27), AFE2/FL3 (R22_AFE2_FL3.1)
NetC1_28: EMG_Sensor_Board (C1.28), AFE2/FL3 (R21_AFE2_FL3.1)
NetC1_29: EMG_Sensor_Board (C1.29), AFE2/FL2 (R22_AFE2_FL2.1)
NetC1_30: EMG_Sensor_Board (C1.30), AFE2/FL2 (R21_AFE2_FL2.1)
NetC1_31: EMG_Sensor_Board (C1.31), AFE2/FL1 (R22_AFE2_FL1.1)
NetC1_32: EMG_Sensor_Board (C1.32), AFE2/FL1 (R21_AFE2_FL1.1)
NetC46_AFE1_FL1_1: AFE1 (U?#1.16), AFE1/FL1 (C46_AFE1_FL1.1 R21_AFE1_FL1.2)
NetC46_AFE1_FL2_1: AFE1 (U?#1.14), AFE1/FL2 (C46_AFE1_FL2.1 R21_AFE1_FL2.2)
NetC46_AFE1_FL3_1: AFE1 (U?#1.12), AFE1/FL3 (C46_AFE1_FL3.1 R21_AFE1_FL3.2)
NetC46_AFE1_FL4_1: AFE1 (U?#1.10), AFE1/FL4 (C46_AFE1_FL4.1 R21_AFE1_FL4.2)
NetC46_AFE1_FL5_1: AFE1 (U?#1.8), AFE1/FL5 (C46_AFE1_FL5.1 R21_AFE1_FL5.2)
NetC46_AFE1_FL6_1: AFE1 (U?#1.6), AFE1/FL6 (C46_AFE1_FL6.1 R21_AFE1_FL6.2)
NetC46_AFE1_FL7_1: AFE1 (U?#1.4), AFE1/FL7 (C46_AFE1_FL7.1 R21_AFE1_FL7.2)
NetC46_AFE1_FL8_1: AFE1 (U?#1.2), AFE1/FL8 (C46_AFE1_FL8.1 R21_AFE1_FL8.2)
NetC46_AFE2_FL1_1: AFE2 (U?#2.16), AFE2/FL1 (C46_AFE2_FL1.1 R21_AFE2_FL1.2)
NetC46_AFE2_FL2_1: AFE2 (U?#2.14), AFE2/FL2 (C46_AFE2_FL2.1 R21_AFE2_FL2.2)
NetC46_AFE2_FL3_1: AFE2 (U?#2.12), AFE2/FL3 (C46_AFE2_FL3.1 R21_AFE2_FL3.2)
NetC46_AFE2_FL4_1: AFE2 (U?#2.10), AFE2/FL4 (C46_AFE2_FL4.1 R21_AFE2_FL4.2)
NetC46_AFE2_FL5_1: AFE2 (U?#2.8), AFE2/FL5 (C46_AFE2_FL5.1 R21_AFE2_FL5.2)
NetC46_AFE2_FL6_1: AFE2 (U?#2.6), AFE2/FL6 (C46_AFE2_FL6.1 R21_AFE2_FL6.2)
NetC46_AFE2_FL7_1: AFE2 (U?#2.4), AFE2/FL7 (C46_AFE2_FL7.1 R21_AFE2_FL7.2)
NetC46_AFE2_FL8_1: AFE2 (U?#2.2), AFE2/FL8 (C46_AFE2_FL8.1 R21_AFE2_FL8.2)
NetC47_AFE1_FL1_2: AFE1 (U?#1.15), AFE1/FL1 (C47_AFE1_FL1.2 R22_AFE1_FL1.2)
NetC47_AFE1_FL2_2: AFE1 (U?#1.13), AFE1/FL2 (C47_AFE1_FL2.2 R22_AFE1_FL2.2)
NetC47_AFE1_FL3_2: AFE1 (U?#1.11), AFE1/FL3 (C47_AFE1_FL3.2 R22_AFE1_FL3.2)
NetC47_AFE1_FL4_2: AFE1 (U?#1.9), AFE1/FL4 (C47_AFE1_FL4.2 R22_AFE1_FL4.2)
NetC47_AFE1_FL5_2: AFE1 (U?#1.7), AFE1/FL5 (C47_AFE1_FL5.2 R22_AFE1_FL5.2)
NetC47_AFE1_FL6_2: AFE1 (U?#1.5), AFE1/FL6 (C47_AFE1_FL6.2 R22_AFE1_FL6.2)
NetC47_AFE1_FL7_2: AFE1 (U?#1.3), AFE1/FL7 (C47_AFE1_FL7.2 R22_AFE1_FL7.2)
NetC47_AFE1_FL8_2: AFE1 (U?#1.1), AFE1/FL8 (C47_AFE1_FL8.2 R22_AFE1_FL8.2)
NetC47_AFE2_FL1_2: AFE2 (U?#2.15), AFE2/FL1 (C47_AFE2_FL1.2 R22_AFE2_FL1.2)
NetC47_AFE2_FL2_2: AFE2 (U?#2.13), AFE2/FL2 (C47_AFE2_FL2.2 R22_AFE2_FL2.2)
NetC47_AFE2_FL3_2: AFE2 (U?#2.11), AFE2/FL3 (C47_AFE2_FL3.2 R22_AFE2_FL3.2)
NetC47_AFE2_FL4_2: AFE2 (U?#2.9), AFE2/FL4 (C47_AFE2_FL4.2 R22_AFE2_FL4.2)
NetC47_AFE2_FL5_2: AFE2 (U?#2.7), AFE2/FL5 (C47_AFE2_FL5.2 R22_AFE2_FL5.2)
NetC47_AFE2_FL6_2: AFE2 (U?#2.5), AFE2/FL6 (C47_AFE2_FL6.2 R22_AFE2_FL6.2)
NetC47_AFE2_FL7_2: AFE2 (U?#2.3), AFE2/FL7 (C47_AFE2_FL7.2 R22_AFE2_FL7.2)
NetC47_AFE2_FL8_2: AFE2 (U?#2.1), AFE2/FL8 (C47_AFE2_FL8.2 R22_AFE2_FL8.2)
NetR24_2: EMG_Sensor_Board (R24.2), AFE1 (U?#1.42)
NetR25_1: EMG_Sensor_Board (R25.1), AFE2 (U?#2.42)
NetU?#1_37: AFE1 (U?#1.37), AFE2 (U?#2.37)
nRST: EMG_Sensor_Board (J1.10), MCU (C15.1 U3.8)
RF1: MCU (U3.31), RF (C48.1 L4.1)
SPI2_MISO: EMG_Sensor_Board (B6.6 J3.7 J12.4), MCU (U3.11)
SPI2_MOSI: EMG_Sensor_Board (B6.3 J3.3 J12.3), MCU (U3.10)
SPI2_NCS1: EMG_Sensor_Board (B6.4 J3.2 J12.2), MCU (R6.1 U3.12)
SPI2_SCK: EMG_Sensor_Board (B6.1 J3.5 J12.1), MCU (U3.24)
SPI_MISO: EMG_Sensor_Board (B2.6 J5.B1), MCU (U3.64), AFE1 (U?#1.43), AFE2 (U?#2.43)
SPI_MOSI: EMG_Sensor_Board (B2.3 J5.A1), MCU (U3.65), AFE1 (U?#1.34), AFE2 (U?#2.34)
SPI_NCS_1: EMG_Sensor_Board (B2.1 J5.A2), MCU (R14.1 U3.62), AFE1 (U?#1.39)
SPI_NCS_2: EMG_Sensor_Board (B2.4 J5.B3), MCU (R15.1 U3.66), AFE2 (U?#2.39)
SPI_SCK: EMG_Sensor_Board (B2.5 J5.B2), MCU (U3.63), AFE1 (U?#1.40), AFE2 (U?#2.40)
START: EMG_Sensor_Board (B3.6 J4.1), MCU (U3.67), AFE1 (R?.2 U?#1.38), AFE2 (R18_AFE2.2 U?#2.38)
SWDCLK: EMG_Sensor_Board (J1.4), MCU (U3.56)
SWDIO: EMG_Sensor_Board (J1.2), MCU (U3.54)
USB_D_N: EMG_Sensor_Board (X1.2), MCU (U3.52)
USB_D_P: EMG_Sensor_Board (X1.3), MCU (U3.53)
V_USB: EMG_Sensor_Board (B1.3 X1.1), Power_Supply (5 pins)